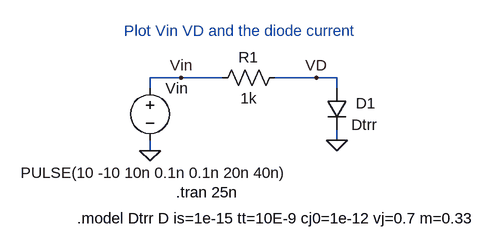
[diagram p0: schematic Fig2_19.asc]
Fig2_19.asc, the LTspice schematic file:
Version 4
SHEET 1 1048 680
WIRE 0 240 0 224
WIRE 0 336 0 320
WIRE 48 224 0 224
WIRE 112 224 48 224
WIRE 256 224 192 224
WIRE 288 224 256 224
WIRE 288 240 288 224
WIRE 288 320 288 304
FLAG 0 336 0
FLAG 288 320 0
FLAG 256 224 VD
FLAG 48 224 Vin
SYMBOL voltage 0 224 R0
WINDOW 123 0 0 Left 0
WINDOW 39 0 0 Left 0
WINDOW 3 -199 146 Left 0
SYMATTR InstName Vin
SYMATTR Value PULSE(10 -10 10n 0.1n 0.1n 20n 40n)
SYMBOL res 96 240 R270
WINDOW 0 32 56 VTop 0
WINDOW 3 0 56 VBottom 0
SYMATTR InstName R1
SYMATTR Value 1k
SYMBOL diode 272 240 R0
WINDOW 0 45 23 Left 0
WINDOW 3 38 56 Left 0
SYMATTR InstName D1
SYMATTR Value Dtrr
TEXT 40 400 Left 0 !.tran 25n
TEXT -112 440 Left 0 !.model Dtrr D is=1e-15 tt=10E-9 cj0=1e-12 vj=0.7 m=0.33
TEXT -40 152 Left 0 ;Plot Vin VD and the diode current

The netlist it stands for:
* Fig2_19.asc
Vin Vin 0 PULSE(10 -10 10n 0.1n 0.1n 20n 40n)
R1 Vin VD 1k
D1 VD 0 Dtrr
.model D D
.lib standard.dio
.tran 25n
.model Dtrr D is=1e-15 tt=10E-9 cj0=1e-12 vj=0.7 m=0.33
* Plot Vin VD and the diode current
.backanno
.end